# Altium project OLED MOD.PrjPcb
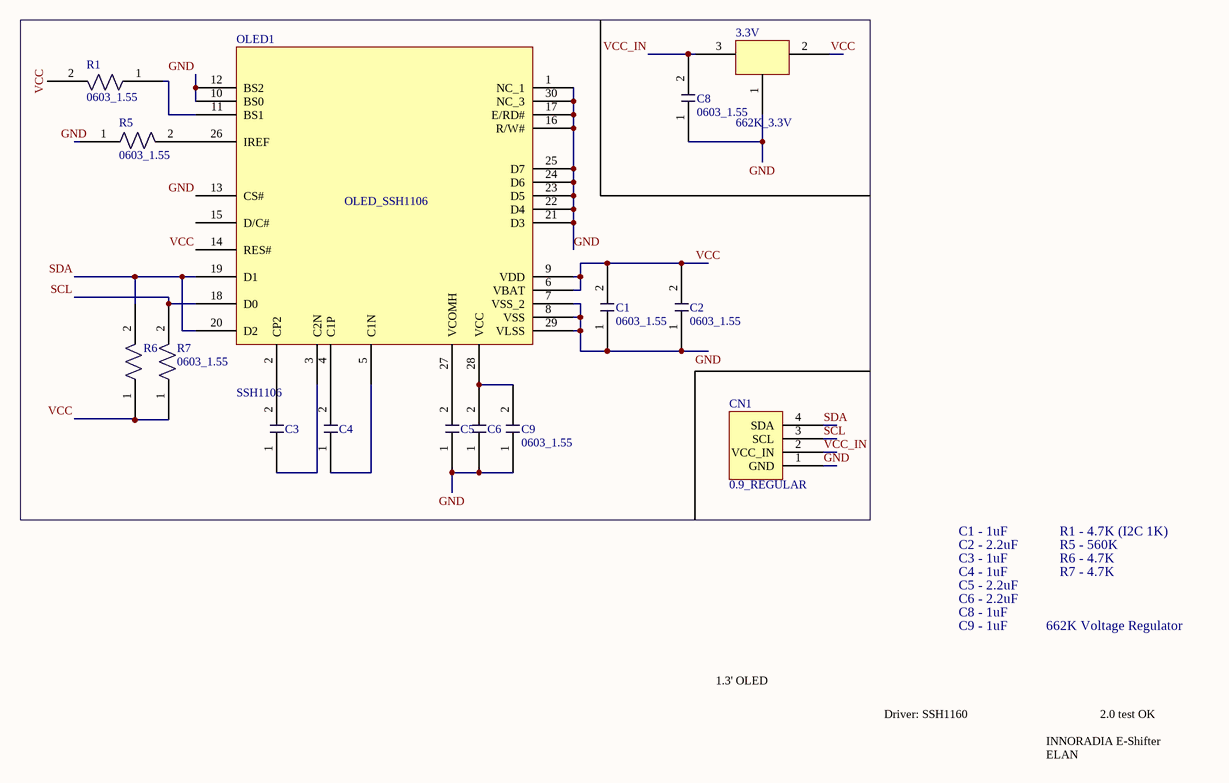
[diagram p0: Sheet.SchDoc]
1 sheet, 15 parts. Net scope: global (net labels, ports and power ports of the same name join across sheets).
Board file: PCB.PcbDoc

## Sheet Sheet.SchDoc
size A4; SheetNumber: 1; SheetTotal: 1

### Parts
3.3V  662K_3.3V  [662K_3.3V]
C1  0603_1.55  [C_0603]
C2  0603_1.55  [C_0603]
C3  0603_1.55  [C_0603]  (value not drawn)
C4  0603_1.55  [C_0603]  (value not drawn)
C5  0603_1.55  [C_0603]  (value not drawn)
C6  0603_1.55  [C_0603]  (value not drawn)
C8  0603_1.55  [C_0603]
C9  0603_1.55  [C_0603]
CN1  0.9_REGULAR  [CONNECTOR]
OLED1  SSH1106  [OLED_1.3]
R1  0603_1.55  [R_0603]
R5  0603_1.55  [R_0603]
R6  0603_1.55  [R_0603]  (value not drawn)
R7  0603_1.55  [R_0603]

### Nets
GND: 3.3V.1 C1.1 C2.1 C5.1 C6.1 C8.1 C9.1 CN1.1(GND) OLED1.1(NC_1) OLED1.7(VSS_2) OLED1.8(VSS) OLED1.10(BS0) OLED1.12(BS2) OLED1.13(CS#) OLED1.16(R/W#) OLED1.17(E/RD#) OLED1.21(D3) OLED1.22(D4) OLED1.23(D5) OLED1.24(D6) OLED1.25(D7) OLED1.29(VLSS) OLED1.30(NC_3) R5.1
SCL: CN1.3(SCL) OLED1.18(D0) R7.2
SDA: CN1.4(SDA) OLED1.19(D1) OLED1.20(D2) R6.2
VCC: 3.3V.2 C1.2 C2.2 OLED1.6(VBAT) OLED1.9(VDD) OLED1.14(RES#) R1.2 R6.1 R7.1
VCC_IN: 3.3V.3 C8.2 CN1.2(VCC_IN)
NetC3_1: C3.1 OLED1.3(C2N)
NetC3_2: C3.2 OLED1.2(CP2)
NetC4_1: C4.1 OLED1.5(C1N)
NetC4_2: C4.2 OLED1.4(C1P)
NetC5_2: C5.2 OLED1.27(VCOMH)
NetC6_2: C6.2 C9.2 OLED1.28(VCC)
NetOLED1_11: OLED1.11(BS1) R1.1
NetOLED1_26: OLED1.26(IREF) R5.2

Not connected (* = marked no-connect by the designer): OLED1 15(D/C#)

### Notes on the sheet
- C2 - 2.2uF
- C1 - 1uF
- R1 - 4.7K (I2C 1K)
- R5 - 560K
- C3 - 1uF
- C4 - 1uF
- C5 - 2.2uF
- C6 - 2.2uF
- R6 - 4.7K
- R7 - 4.7K
- 1.3' OLED
- C8 - 1uF
- C9 - 1uF
- 662K Voltage Regulator
- Driver: SSH1160
- INNORADIA E-Shifter
- 2.0 test OK
- ELAN
- (in symbol OLED_1.3) OLED_SSH1106

### Library data of the parts
C1-C6 C8 C9 = C_0603
CN1 = CONNECTOR
OLED1 = OLED_1.3
R1 R5-R7 = R_0603